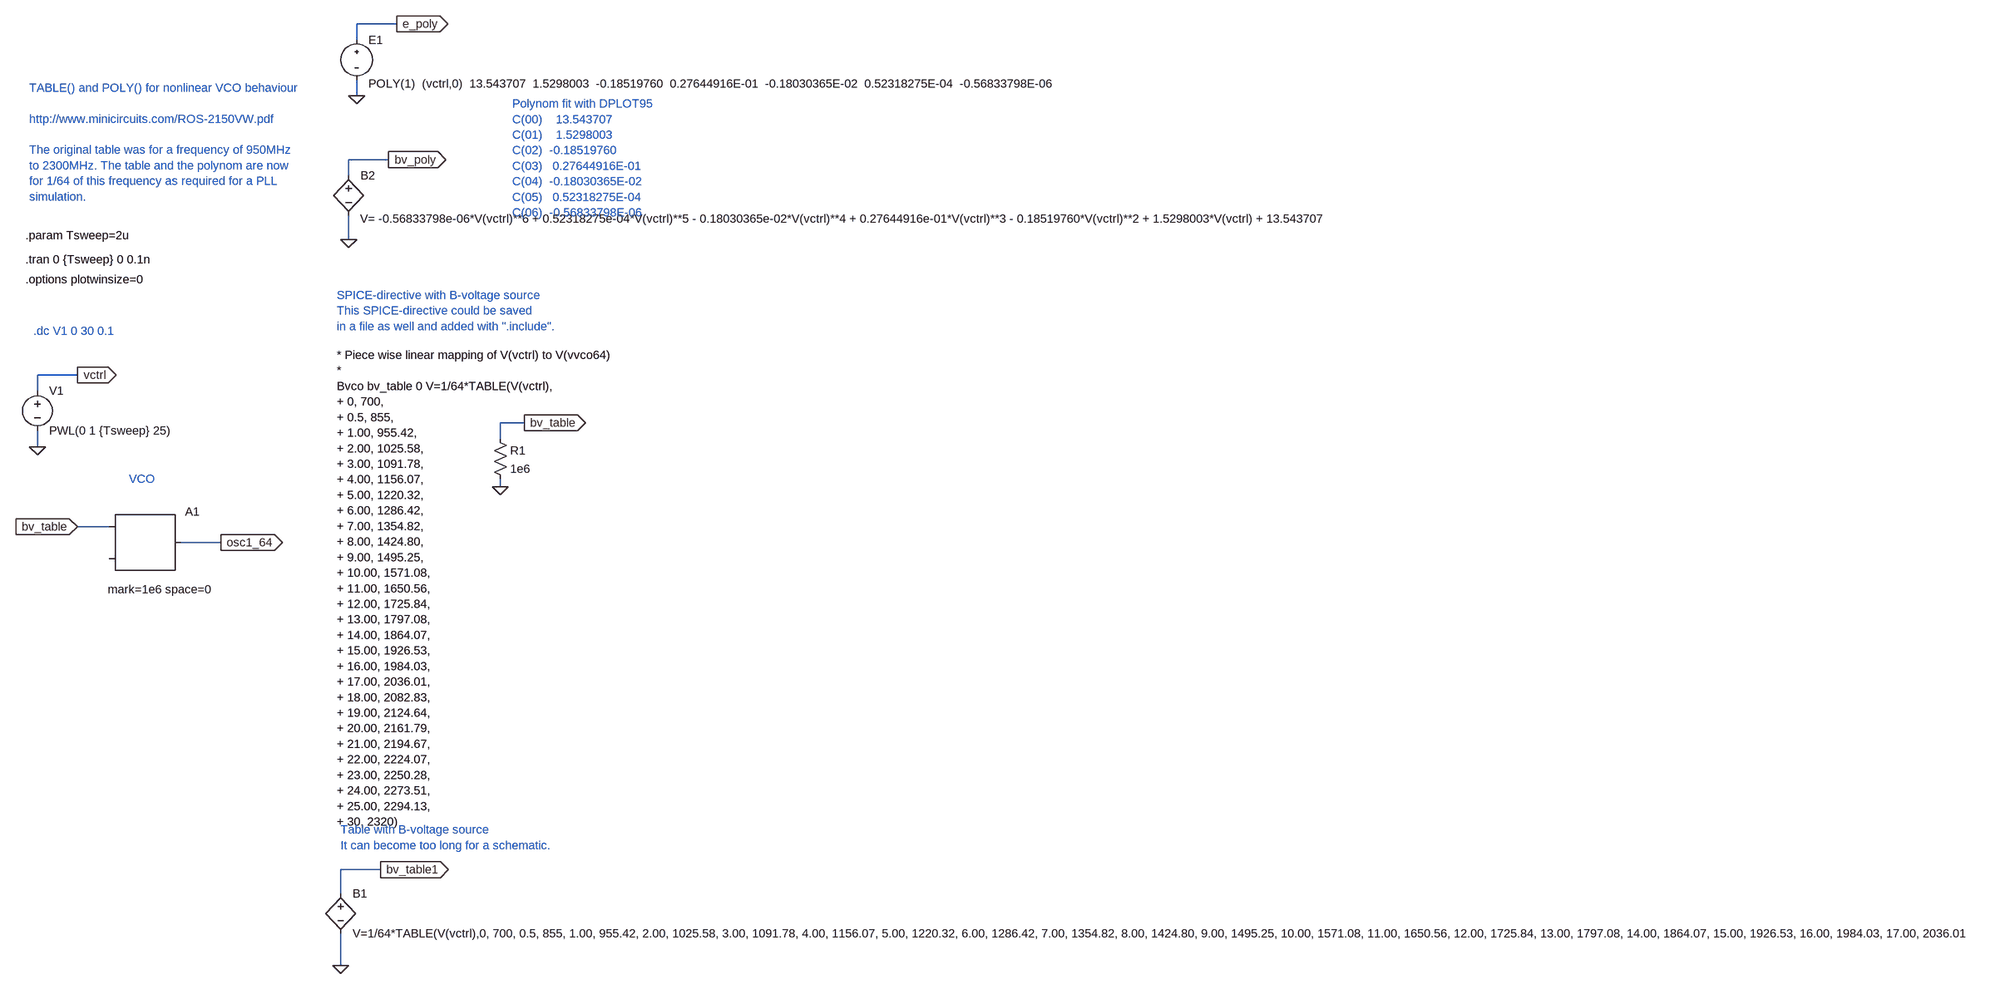
[diagram p0: schematic vco_table_poly.asc]
vco_table_poly.asc, the LTspice schematic file:
Version 4
SHEET 1 6048 868
WIRE 32 -416 32 -448
WIRE 32 -304 32 -336
WIRE 112 -448 32 -448
WIRE 176 -144 112 -144
WIRE 400 -112 320 -112
WIRE 640 592 640 544
WIRE 640 736 640 672
WIRE 656 -848 656 -880
WIRE 656 -720 656 -768
WIRE 672 -1120 672 -1152
WIRE 672 -1008 672 -1040
WIRE 720 544 640 544
WIRE 736 -880 656 -880
WIRE 752 -1152 672 -1152
WIRE 960 -320 960 -352
WIRE 960 -224 960 -240
WIRE 1008 -352 960 -352
FLAG 640 736 0
FLAG 720 544 bv_table1
IOPIN 720 544 Out
FLAG 32 -304 0
FLAG 112 -448 vctrl
IOPIN 112 -448 Out
FLAG 960 -224 0
FLAG 1008 -352 bv_table
IOPIN 1008 -352 Out
FLAG 112 -144 bv_table
IOPIN 112 -144 In
FLAG 400 -112 osc1_64
IOPIN 400 -112 Out
FLAG 656 -720 0
FLAG 736 -880 bv_poly
IOPIN 736 -880 Out
FLAG 672 -1008 0
FLAG 752 -1152 e_poly
IOPIN 752 -1152 Out
SYMBOL bv 640 576 R0
SYMATTR InstName B1
SYMATTR Value V=1/64*TABLE(V(vctrl),0, 700, 0.5, 855, 1.00, 955.42, 2.00, 1025.58, 3.00, 1091.78, 4.00, 1156.07, 5.00, 1220.32, 6.00, 1286.42, 7.00, 1354.82, 8.00, 1424.80, 9.00, 1495.25, 10.00, 1571.08, 11.00, 1650.56, 12.00, 1725.84, 13.00, 1797.08, 14.00, 1864.07, 15.00, 1926.53, 16.00, 1984.03, 17.00, 2036.01, 18.00, 2082.83, 19.00, 2124.64, 20.00, 2161.79, 21.00, 2194.67, 22.00, 2224.07, 23.00, 2250.28, 24.00, 2273.51, 25.00, 2294.13, 30, 2320)
SYMBOL voltage 32 -432 R0
WINDOW 123 0 0 Left 0
WINDOW 39 0 0 Left 0
SYMATTR InstName V1
SYMATTR Value PWL(0 1 {Tsweep} 25)
SYMBOL res 944 -336 R0
SYMATTR InstName R1
SYMATTR Value 1e6
SYMBOL SpecialFunctions\\modulate 176 -144 R0
WINDOW 123 -3 126 Left 0
SYMATTR InstName A1
SYMATTR Value2 mark=1e6 space=0
SYMBOL bv 656 -864 R0
WINDOW 3 23 103 Left 0
SYMATTR InstName B2
SYMATTR Value V= -0.56833798e-06*V(vctrl)**6 + 0.52318275e-04*V(vctrl)**5 - 0.18030365e-02*V(vctrl)**4 + 0.27644916e-01*V(vctrl)**3 - 0.18519760*V(vctrl)**2 + 1.5298003*V(vctrl) + 13.543707
SYMBOL Misc\\Epoly 672 -1136 R0
SYMATTR InstName E1
SYMATTR Value POLY(1)  (vctrl,0)  13.543707  1.5298003  -0.18519760  0.27644916E-01  -0.18030365E-02  0.52318275E-04  -0.56833798E-06
TEXT 24 -536 Left 0 ;.dc V1 0 30 0.1
TEXT 632 -488 Left 0 !* Piece wise linear mapping of V(vctrl) to V(vvco64)\n*\nBvco bv_table 0 V=1/64*TABLE(V(vctrl),\n+ 0, 700,\n+ 0.5, 855,\n+ 1.00, 955.42,\n+ 2.00, 1025.58,\n+ 3.00, 1091.78,\n+ 4.00, 1156.07,\n+ 5.00, 1220.32,\n+ 6.00, 1286.42,\n+ 7.00, 1354.82,\n+ 8.00, 1424.80,\n+ 9.00, 1495.25,\n+ 10.00, 1571.08,\n+ 11.00, 1650.56,\n+ 12.00, 1725.84,\n+ 13.00, 1797.08,\n+ 14.00, 1864.07,\n+ 15.00, 1926.53,\n+ 16.00, 1984.03,\n+ 17.00, 2036.01,\n+ 18.00, 2082.83,\n+ 19.00, 2124.64,\n+ 20.00, 2161.79,\n+ 21.00, 2194.67,\n+ 22.00, 2224.07,\n+ 23.00, 2250.28,\n+ 24.00, 2273.51,\n+ 25.00, 2294.13,\n+ 30, 2320)
TEXT 8 -680 Left 0 !.tran 0 {Tsweep} 0 0.1n
TEXT 8 -640 Left 0 !.options plotwinsize=0
TEXT 984 -992 Left 0 ;Polynom fit with DPLOT95\nC(00)    13.543707    \nC(01)    1.5298003    \nC(02)  -0.18519760    \nC(03)   0.27644916E-01\nC(04)  -0.18030365E-02\nC(05)   0.52318275E-04\nC(06)  -0.56833798E-06
TEXT 216 -240 Left 0 ;VCO
TEXT 8 -728 Left 0 !.param Tsweep=2u
TEXT 632 -608 Left 0 ;SPICE-directive with B-voltage source\nThis SPICE-directive could be saved\nin a file as well and added with ".include".
TEXT 640 464 Left 0 ;Table with B-voltage source\nIt can become too long for a schematic.
TEXT 16 -1024 Left 0 ;TABLE() and POLY() for nonlinear VCO behaviour\n \nhttp://www.minicircuits.com/ROS-2150VW.pdf\n \nThe original table was for a frequency of 950MHz\nto 2300MHz. The table and the polynom are now\nfor 1/64 of this frequency as required for a PLL \nsimulation.

The netlist it stands for:
* vco_table_poly.asc
B1 bv_table1 0 V=1/64*TABLE(V(vctrl),0, 700, 0.5, 855, 1.00, 955.42, 2.00, 1025.58, 3.00, 1091.78, 4.00, 1156.07, 5.00, 1220.32, 6.00, 1286.42, 7.00, 1354.82, 8.00, 1424.80, 9.00, 1495.25, 10.00, 1571.08, 11.00, 1650.56, 12.00, 1725.84, 13.00, 1797.08, 14.00, 1864.07, 15.00, 1926.53, 16.00, 1984.03, 17.00, 2036.01, 18.00, 2082.83, 19.00, 2124.64, 20.00, 2161.79, 21.00, 2194.67, 22.00, 2224.07, 23.00, 2250.28, 24.00, 2273.51, 25.00, 2294.13, 30, 2320)
V1 vctrl 0 PWL(0 1 {Tsweep} 25)
R1 bv_table 0 1e6
A1 bv_table 0 0 0 0 0 osc1_64 0 MODULATOR mark=1e6 space=0
B2 bv_poly 0 V= -0.56833798e-06*V(vctrl)**6 + 0.52318275e-04*V(vctrl)**5 - 0.18030365e-02*V(vctrl)**4 + 0.27644916e-01*V(vctrl)**3 - 0.18519760*V(vctrl)**2 + 1.5298003*V(vctrl) + 13.543707
E1 e_poly 0 POLY(1)  (vctrl,0)  13.543707  1.5298003  -0.18519760  0.27644916E-01  -0.18030365E-02  0.52318275E-04  -0.56833798E-06
* .dc V1 0 30 0.1
* Piece wise linear mapping of V(vctrl) to V(vvco64)
*
Bvco bv_table 0 V=1/64*TABLE(V(vctrl),
+ 0, 700,
+ 0.5, 855,
+ 1.00, 955.42,
+ 2.00, 1025.58,
+ 3.00, 1091.78,
+ 4.00, 1156.07,
+ 5.00, 1220.32,
+ 6.00, 1286.42,
+ 7.00, 1354.82,
+ 8.00, 1424.80,
+ 9.00, 1495.25,
+ 10.00, 1571.08,
+ 11.00, 1650.56,
+ 12.00, 1725.84,
+ 13.00, 1797.08,
+ 14.00, 1864.07,
+ 15.00, 1926.53,
+ 16.00, 1984.03,
+ 17.00, 2036.01,
+ 18.00, 2082.83,
+ 19.00, 2124.64,
+ 20.00, 2161.79,
+ 21.00, 2194.67,
+ 22.00, 2224.07,
+ 23.00, 2250.28,
+ 24.00, 2273.51,
+ 25.00, 2294.13,
+ 30, 2320)
.tran 0 {Tsweep} 0 0.1n
.options plotwinsize=0
* Polynom fit with DPLOT95
* C(00)    13.543707
* C(01)    1.5298003
* C(02)  -0.18519760
* C(03)   0.27644916E-01
* C(04)  -0.18030365E-02
* C(05)   0.52318275E-04
* C(06)  -0.56833798E-06
* VCO
.param Tsweep=2u
* SPICE-directive with B-voltage source
* This SPICE-directive could be saved
* in a file as well and added with ".include".
* Table with B-voltage source
* It can become too long for a schematic.
* TABLE() and POLY() for nonlinear VCO behaviour
* http://www.minicircuits.com/ROS-2150VW.pdf
* The original table was for a frequency of 950MHz
* to 2300MHz. The table and the polynom are now
* for 1/64 of this frequency as required for a PLL
* simulation.
.backanno
.end